# EAGLE design PFETswitch (EAGLE 9.6.2)
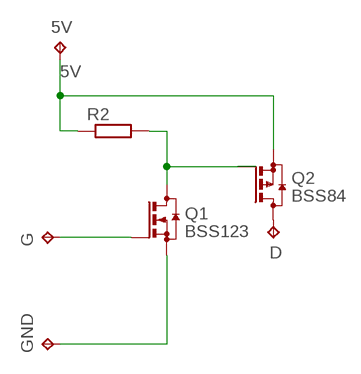
[diagram p0: schematic, sheet 1]

## Parts
5V  TPTP09SQ  [TP09SQ]
D  TPTP09SQ  [TP09SQ]
G  TPTP09SQ  [TP09SQ]
GND  TPTP09SQ  [TP09SQ]
Q1  BSS123  [SOT23]
Q2  BSS84  [SOT23]
R2  R-EU_R0603  [R0603]

## Nets
5V: 5V.TP Q2.2(S) R2.1
N$1: G.TP Q1.1(G)
N$2: Q1.3(D) Q2.1(G) R2.2
N$3: GND.TP Q1.2(S)
N$4: D.TP Q2.3(D)

## Library data of the parts
5V D G GND = testpad:TP: Test pad
Q1 = transistor-small-signal:BSS123: N-CHANNEL MOS FET
Q2 = transistor-small-signal:BSS84: P-CHANNEL MOS FET
R2 = rcl:R-EU_: RESISTOR, European symbol; SPICEPREFIX: R

## Board
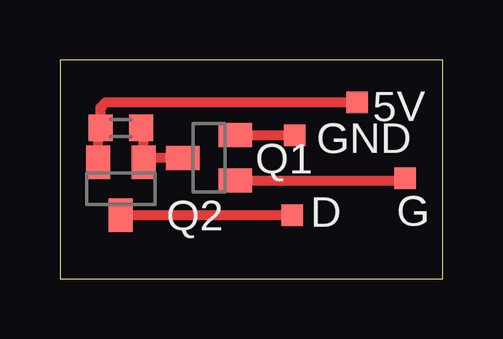
[diagram p1: board, top side]

Size 15.98 x 9.13 mm. Coordinates in mm from the lower left corner, seen from the top.
Outline: 0,0 15.98,0 15.98,9.13 0,9.13 0,0
Copper layers (1*16): Top 0.035mm / dielectric 1.5mm / Bottom 0.035mm
Design rules "default": minimum track width 6mil, minimum drill 0.35mm, track to track 6mil, track to pad 6mil, pad to pad 6mil, via to via 6mil, smd to smd 6mil, copper to edge 40mil, drill to drill 6mil, minimum pad ring 10mil, minimum via ring 8mil, stop-mask expansion 4mil, vias tented up to drill 0mil, thermal gap 10mil

### Footprints (pad centres in the part's own frame; a part is rotated, then mirrored left to right if it is on the bottom)
TP09SQ = smd 0.9 x 0.9: TP 0,0
SOT23 = smd 1 x 1.4: 1 -0.95,-1.1; 2 0.95,-1.1; 3 0,1.1
R0603 = smd 1 x 1.1: 1 -0.85,0; 2 0.85,0

### Placement (x,y rotation side)
5V  12.39,7.37 0 top
D  9.7,2.65 0 top
G  14.39,4.2 0 top
GND  9.79,5.98 0 top
Q1  6.22,5.05 90 top
Q2  2.54,3.76 180 top
R2  2.54,6.3 0 top

### Tracks (layer width: path | path; a pad name or v marks a point on that pad's centre or on a via)
5V
  Top 0.406: 5V.TP 1.91,7.37 1.69,7.15 R2.1 1.59,6.2 Q2.2
N$1
  Top 0.406: 14.2,4 G.TP | 14.35,4.15 G.TP | G.TP 14.3,4.1 Q1.1
N$2
  Top 0.406: Q2.1 3.49,5.4 | 3.49,5.4 3.49,6.2 R2.2 | Q1.3 3.84,5.05 3.49,5.4
N$3
  Top 0.406: 7.62,5.7 Q1.2 9.77,6 GND.TP
N$4
  Top 0.406: 9.65,2.69 D.TP Q2.3 2.62,2.74